# EAGLE design Sound_MP3-TF-16P (EAGLE 9.5.2)
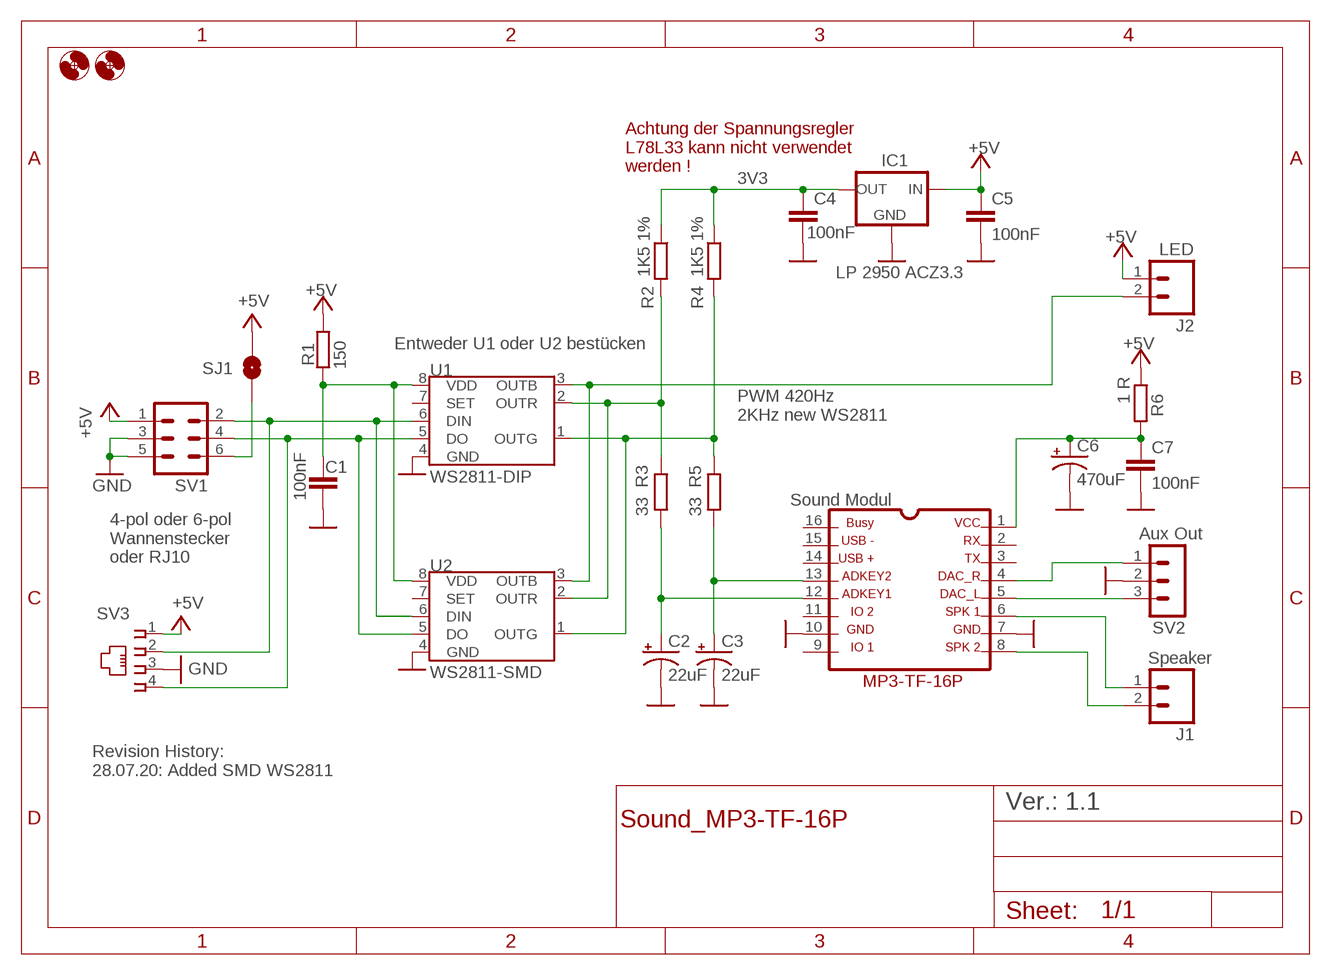
[diagram p0: schematic, sheet 1]

## Parts
C1  100nF  0.1UF-50V-20%(PTH)KIT-EZ  [CAP-PTH-SMALL-KIT]
C2  22uF  CAPACITORS_22UF  [CAPACITOR_CPOL-RADIAL-22UF]
C3  22uF  CAPACITORS_22UF  [CAPACITOR_CPOL-RADIAL-22UF]
C4  100nF  0.1UF-50V-20%(PTH)KIT-EZ  [CAP-PTH-SMALL-KIT]
C5  100nF  0.1UF-50V-20%(PTH)KIT-EZ  [CAP-PTH-SMALL-KIT]
C6  470uF  SPARKFUN-CAPACITORS_100UF-25V-20%(PTH)  [SPARKFUN-CAPACITORS_CPOL-RADIAL-100UF-25V]
C7  100nF  0.1UF-50V-20%(PTH)KIT-EZ  [CAP-PTH-SMALL-KIT]
H1  MOUNT-HOLE3.0  [3,0]
H3  MOUNT-HOLE3.0  [3,0]
IC1  LP 2950 ACZ3.3  78LXX  [78LXX]
J1  Speaker  M02PTH  [1X02]
J2  LED  M02PTH  [1X02]
MOD1  Sound Modul  MP3-TF-16P_MP3-TF-16P  [MP3-TF-16P_MP3-TF-16P]
R1  150  RCL_R-EU_0204/5  [RCL_0204/5]
R2  1K5 1%  RCL_R-EU_0204/5  [RCL_0204/5]
R3  33  RCL_R-EU_0204/5  [RCL_0204/5]
R4  1K5 1%  RCL_R-EU_0204/5  [RCL_0204/5]
R5  33  RCL_R-EU_0204/5  [RCL_0204/5]
R6  1 R  RCL_R-EU_0204/5  [RCL_0204/5]
SJ1  Pin6 = 5V  SOLDERJUMPERNO  [SJ_2S-NO]
SV1  ML6  [ML6]
SV2  Aux Out  MA03-1  [MA03-1]
SV3  RJ10RJ10_WO_OVERLAP  [RJ10_NO_OVERLAP_BORDER]
U1  WS2811-DIP  S3PO_MODUL_WS2811_SOUND_MP3-TF-16P_WS2811_AND_ATTINY_WS2811-ICTINY45-20-DIP  [S3PO_MODUL_WS2811_SOUND_MP3-TF-16P_WS2811_AND_ATTINY_WS2811_DIP08]
U2  WS2811-SMD  S3PO_MODUL_WS2811_SOUND_MP3-TF-16P_WS2811_AND_ATTINY_WS2811-ICTINY45-20-SMT  [S3PO_MODUL_WS2811_SOUND_MP3-TF-16P_WS2811_AND_ATTINY_WS2811_SO08-EIAJ]

## Nets
3V3: C4.1 IC1.OUT R2.1 R4.1
+5V: C5.1 IC1.IN J2.1 R1.2 R6.1 SJ1.1 SV1.1 SV3.1
+5V1: SJ1.2 SV1.6
G1: R4.2 R5.1 U1.1(OUTG) U2.1(OUTG)
GND: C1.2 C2.2(-) C3.2(-) C4.2 C5.2 C6.2(-) C7.2 IC1.GND MOD1.7 MOD1.10 SV1.3 SV1.5 SV2.2 SV3.3 U1.4(GND) U2.4(GND)
N$1: MOD1.5 SV2.3
N$2: MOD1.4 SV2.1
N$3: SV1.2 SV3.2 U1.6(DIN) U2.6(DIN)
N$4: SV1.4 SV3.4 U1.5(DO) U2.5(DO)
N$5: J1.1 MOD1.6
N$6: J1.2 MOD1.8
N$7: C2.1(+) MOD1.12 R3.2
N$8: C3.1(+) MOD1.13 R5.2
N$9: C6.1(+) C7.1 MOD1.1 R6.2
N$10: J2.2 U1.3(OUTB) U2.3(OUTB)
PWR1: C1.1 R1.1 U1.8(VDD) U2.8(VDD)
R1: R2.2 R3.1 U1.2(OUTR) U2.2(OUTR)
Unconnected: MOD1.2 MOD1.3 MOD1.9 MOD1.11 MOD1.14 MOD1.15 MOD1.16 U1.7(SET) U2.7(SET)

## Notes on the sheet
- Achtung der Spannungsregler
  L78L33 kann nicht verwendet
  werden !
- Entweder U1 oder U2 bestücken
- PWM 420Hz
  2KHz new WS2811
- 4-pol oder 6-pol 
  Wannenstecker
  oder RJ10
- Revision History:
  28.07.20: Added SMD WS2811
- Ver.: 1.1

## Library data of the parts
C1 C4 C5 C7 = SparkFun-Capacitors:0.1UF-50V-20%(PTH): CAP-08370; PROD_ID: CAP-08370
C2 C3 = Sound_MP3-TF-16P_WS2811_and_ATTiny:CAPACITORS_22UF: CAP-08439; PROD_ID: CAP-08439
C6 = Sound_MP3-TF-16P_and_WS2811:SPARKFUN-CAPACITORS_100UF-25V-20%(PTH): CAP-08439; PROD_ID: CAP-08439
H1 H3 = holes:MOUNT-HOLE: MOUNTING HOLE with drill center marker
IC1 = v-reg-3:78LXX: VOLTAGE REGULATOR
J1 J2 = SparkFun-Connectors:M02: Standard 2-pin 0.1" header. Use with - straight break away headers ( PRT-00116) - right angle break away headers (PRT-00553) - swiss pins (PRT-00743) - machine pins (PRT-00117) - female headers (PRT-00115) Molex polarized connector foot print use with: PRT-08233 with associated crimp pins and housings. 2.54_SCREWTERM for use with PRT-10571. 3.5mm Screw Terminal footprints for PRT-08084 5mm Screw Terminal footprints for use with PRT-08432
MOD1 = Sound_MP3-TF-16P_WS2811_and_ATTiny:MP3-TF-16P_MP3-TF-16P: MP3-TF-16P http://www.electronicoscaldas.com/datasheet/DFR0299-DFPlayer-Mini-Manual.pdf; OC_FARNELL: unknown; OC_NEWARK: unknown
R1-R6 = Sound_MP3-TF-16P_and_WS2811:RCL_R-EU_: RESISTOR, European symbol; SPICEPREFIX: R
SJ1 = SparkFun-Retired:SOLDERJUMPER: Solder Jumper Standard SMD solder jumper. Used to automate production. Two varients : Normally Open and Normally Closed are the same, but have different paste layers. NC will have a large amount of paste and should jumper during reflow.
SV1 = con-harting-ml:ML6: HARTING; OC_FARNELL: unknown; OC_NEWARK: unknown
SV2 = con-lstb:MA03-1: PIN HEADER
SV3 = RJ10:RJ10: RJ10 Connector "C:\Dat\Märklin\Schaltpläne\Allgemein\RJ10_Stecker_Layout.docx" https://de.aliexpress.com/item/100-pcs-lot-RJ11-Grau-4P4-Telefon-Buchse-4P4C-Telefon-Halter-RJ10-Telefon-Halter-PCB-Empf/32951511491.html?spm=a2g0x.search0604.3.106.53184c516NAPTE&transAbTest=ae803_4&ws_ab_test=searchweb0_0%2Csearchweb201602_3_10065_10068_10547_319_317_10548_10696_10084_453_10083_454_10618_10304_10307_10820_10821_537_10302_536_10902_10843_10059_10884_10887_321_322_10103%2Csearchweb201603_57%2CppcSwitch_0&algo_pvid=cf281ae9-d22a-4418-b1b2-d9dd3eca3a16&algo_expid=cf281ae9-d22a-4418-b1b2-d9dd3eca3a16-15
U1 = S3PO_Modul_WS2811:S3PO_MODUL_WS2811_SOUND_MP3-TF-16P_WS2811_AND_ATTINY_WS2811-IC: Die Pin Nummern für R und G sind getauscht damit sie gleich angesteuert werden wie die WS2812. Der Daten Strom der WS2811 ist RGB, Beim WS2812 ist es aber GRB.; PROD_ID: IC-09439; VALUE: TINY45-20-DIP
U2 = S3PO_Modul_WS2811:S3PO_MODUL_WS2811_SOUND_MP3-TF-16P_WS2811_AND_ATTINY_WS2811-IC: Die Pin Nummern für R und G sind getauscht damit sie gleich angesteuert werden wie die WS2812. Der Daten Strom der WS2811 ist RGB, Beim WS2812 ist es aber GRB.; PROD_ID: IC-08922; VALUE: Tiny45-20-SMT

## Board
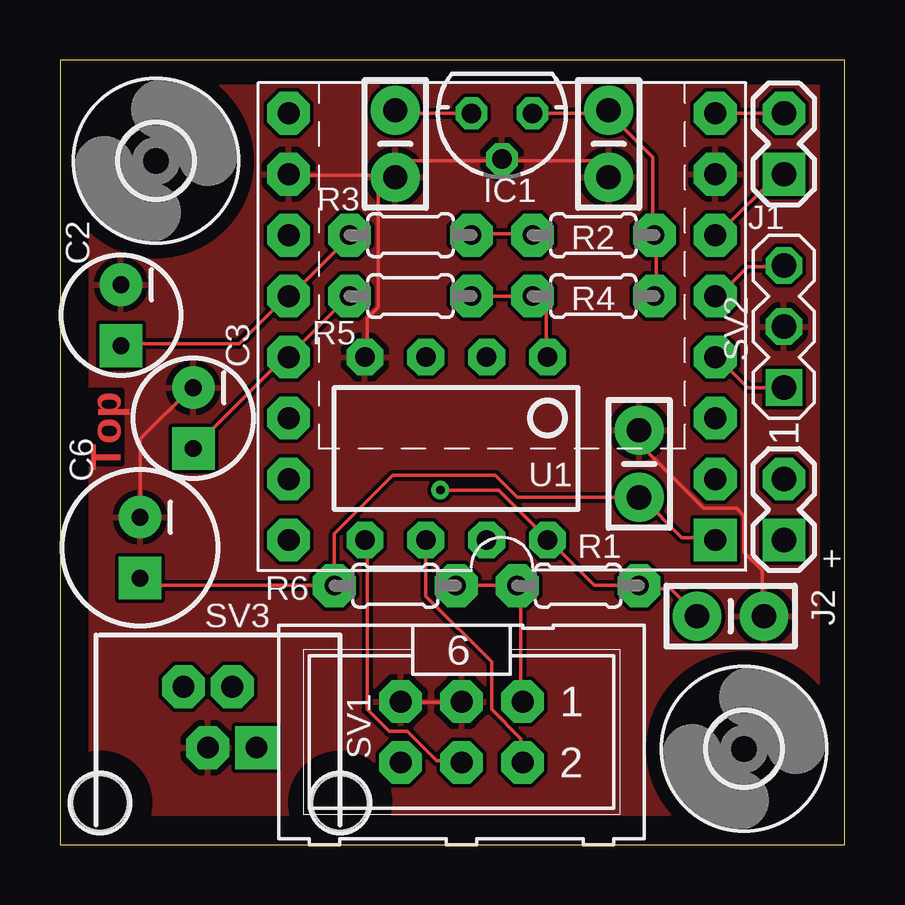
[diagram p1: board, top side]
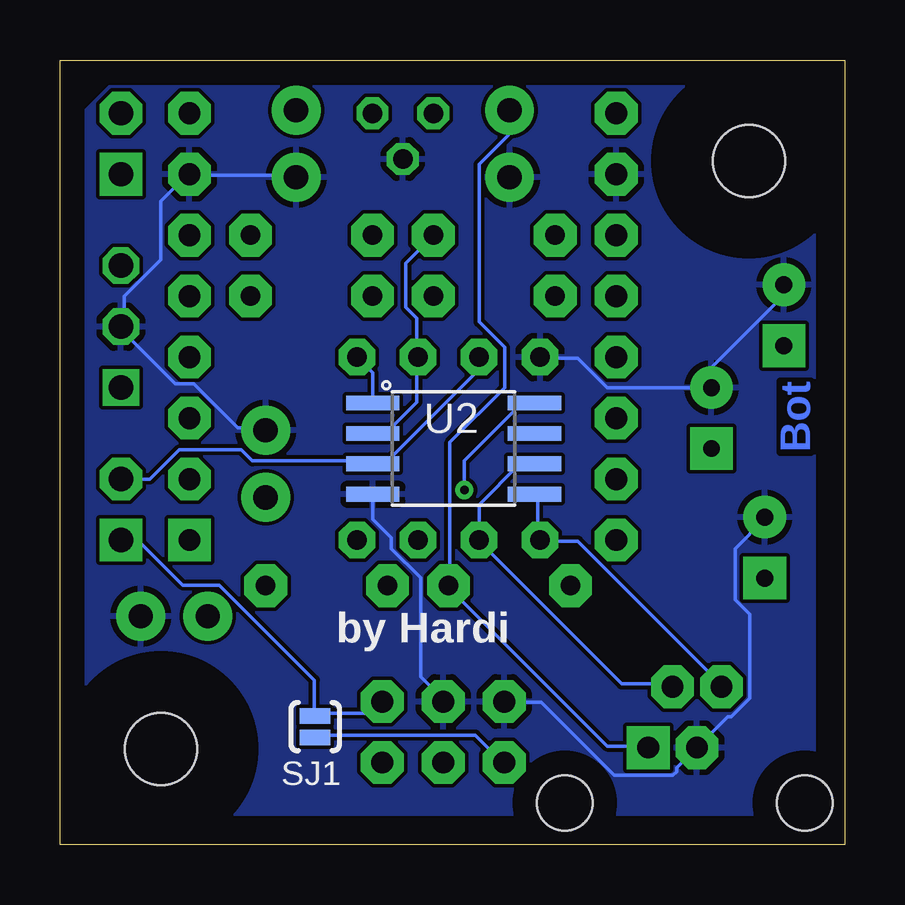
[diagram p2: board, bottom side, seen from below]

Size 32.7 x 32.7 mm. Coordinates in mm from the lower left corner, seen from the top.
Outline: 0,0 32.7,0 32.7,32.7 0,32.7 0,0
Copper layers (1*16): Top 0.035mm / dielectric 1.5mm / Bottom 0.035mm
Design rules "default": minimum track width 6mil, minimum drill 0.35mm, track to track 6mil, track to pad 6mil, pad to pad 6mil, via to via 6mil, smd to smd 6mil, copper to edge 40mil, drill to drill 6mil, minimum pad ring 10mil, minimum via ring 8mil, stop-mask expansion 4mil, vias tented up to drill 0mil, thermal gap 10mil

### Footprints (pad centres in the part's own frame; a part is rotated, then mirrored left to right if it is on the bottom)
CAP-PTH-SMALL-KIT = drill 1.016 pad 2.032: 1 -1.397,0; 2 1.397,0
CAPACITOR_CPOL-RADIAL-22UF = drill 0.7 pad 1.778 square: 1 1.27,0 | drill 0.7 pad 1.778: 2 -1.27,0
SPARKFUN-CAPACITORS_CPOL-RADIAL-100UF-25V = drill 0.7 pad 1.778 square: 1 1.27,0 | drill 0.7 pad 1.778: 2 -1.27,0
3,0 = hole 3: 0,0
78LXX = drill 0.813 octagon: GND 0,1.905; IN 1.27,0; OUT -1.27,0
1X02 = drill 1.016 pad 1.778 square: 1 0,0 | drill 1.016 pad 1.778 octagon: 2 2.54,0
MP3-TF-16P_MP3-TF-16P = drill 0.914 pad 1.778 square: 1 -8.89,16.51 | drill 0.914 pad 1.778 octagon: 2 -8.89,13.97; 3 -8.89,11.43; 4 -8.89,8.89; 5 -8.89,6.35; 6 -8.89,3.81; 7 -8.89,1.27; 8 -8.89,-1.27; 9 8.89,-1.27; 10 8.89,1.27; 11 8.89,3.81; 12 8.89,6.35; 13 8.89,8.89; 14 8.89,11.43; 15 8.89,13.97; 16 8.89,16.51
RCL_0204/5 = drill 0.813 pad 1.778 octagon: 1 -2.54,0; 2 2.54,0
SJ_2S-NO = smd 0.635 x 1.27: 1 -0.45,0; 2 0.45,0
ML6 = drill 0.914 pad 1.778 octagon: 1 -2.54,-1.27; 2 -2.54,1.27; 3 0,-1.27; 4 0,1.27; 5 2.54,-1.27; 6 2.54,1.27
MA03-1 = drill 1.016 pad 1.524 square: 1 -3.81,0 | drill 1.016 pad 1.524 octagon: 2 -1.27,0; 3 1.27,0
RJ10_NO_OVERLAP_BORDER = drill 0.9 pad 1.778 square: 1 -1.524,-2.3 | drill 0.9 pad 1.778 octagon: 2 -0.508,-4.84; 3 0.508,-2.3; 4 1.524,-4.84 | hole 2.3: 5,0; -5,0
S3PO_MODUL_WS2811_SOUND_MP3-TF-16P_WS2811_AND_ATTINY_WS2811_DIP08 = drill 0.813 pad 1.524 octagon: 1 -3.81,-3.81; 2 -1.27,-3.81; 3 1.27,-3.81; 4 3.81,-3.81; 5 3.81,3.81; 6 1.27,3.81; 7 -1.27,3.81; 8 -3.81,3.81
S3PO_MODUL_WS2811_SOUND_MP3-TF-16P_WS2811_AND_ATTINY_WS2811_SO08-EIAJ = smd 0.61 x 2.21: 1 -1.905,-3.378; 2 -0.635,-3.378; 3 0.635,-3.378; 4 1.905,-3.378; 5 1.905,3.353; 6 0.635,3.353; 7 -0.635,3.353; 8 -1.905,3.353

### Placement (x,y rotation side)
C1  27.94,9.53 0 top
C2  2.54,22.07 270 top
C3  5.56,17.78 270 top
C4  22.86,29.21 270 top
C5  13.97,29.21 270 top
C6  3.33,12.38 270 top
C7  24.13,15.88 90 top
H1  4,28.5 0 top
H3  28.5,4 0 top
IC1  18.41,30.48 180 top
J1  30.16,27.94 90 top
J2  30.16,12.7 90 top
MOD1  18.41,29.21 180 top
R1  21.59,10.79 180 top
R2  22.23,25.4 180 top
R3  14.61,25.4 180 top
R4  22.23,22.86 180 top
R5  14.61,22.86 180 top
R6  13.97,10.79 180 top
SJ1  22.07,4.92 270 bottom
SV1  16.73,4.7 180 top
SV2  30.16,22.86 90 top
SV3  6.67,1.75 180 top
U1  16.51,16.51 180 top
U2  16.28,16.51 270 bottom

### Tracks (layer width: path | path; a pad name or v marks a point on that pad's centre or on a via)
3V3
  Top 0.152: R4.1 24.84,22.86 24.84,25.3 R2.1 24.69,25.45 24.69,28.65 22.86,30.48 | 22.86,30.48 IC1.OUT | 22.86,30.48 C4.1
+5V
  Top 0.152: IC1.IN 14.02,30.48 C5.1 | R6.1 16.61,10.82 19.05,10.82 R1.2 19.05,10.67 19.2,10.52 19.2,6.1 SV1.1
  Bottom 0.152: SV1.1 19.36,5.94 19.81,5.49 21.95,5.49 SJ1.1 22.1,5.49 22.1,6.86 26.06,10.82 27.58,10.82 29.41,12.65 30.02,12.65 J2.1 | SV3.1 8.23,4.12 9.91,4.12 16.46,10.67 R6.1 16.46,10.82 16.46,16.76 14.17,19.05 14.17,20.73 15.24,21.79 15.24,28.35 14.02,29.57 14.02,30.48 C5.1
+5V1
  Bottom 0.152: SJ1.2 21.95,4.57 15.39,4.57 14.33,3.5 SV1.6
G1
  Top 0.152: U1.1 20.27,20.42 20.27,22.4 19.81,22.86 R4.2 R5.1
  Bottom 0.152: U2.1 19.66,19.66 U1.1
GND
  Top 0.152: SV1.3 16.61,5.94 14.33,5.94 SV1.5 | C6.2 3.35,13.72 3.35,16.92 5.49,19.05 C3.2 | C5.2 14.02,27.89 14.63,28.5 18.29,28.5 IC1.GND 18.44,28.5 22.25,28.5 22.86,27.89 C4.2 | 13.26,27.89 13.87,27.89 C5.2 | 13.26,27.89 9.6,27.89 MOD1.10 | C1.2 29.26,9.6 29.26,11.43 28.5,12.19 28.5,13.72 28.19,14.02 26.82,14.02 24.23,16.61 24.23,17.22 C7.2 | 13.26,27.89 13.26,22.4 12.8,21.95 12.8,20.42 U1.4 | 13.26,27.89 C5.2
  Bottom 0.152: U2.4 19.66,13.56 18.9,12.8 18.9,12.34 17.68,11.12 17.68,7.01 16.76,6.1 SV1.3 | SV1.5 14.17,5.94 12.65,5.94 9.6,2.9 7.16,2.9 7.01,3.05 7.01,3.2 6.25,3.96 SV3.3 6.1,4.12 4.88,5.33 4.72,5.33 3.96,6.1 3.96,9.6 4.57,10.21 4.57,12.34 3.35,13.56 C6.2 | U1.4 12.65,20.27 11.12,20.27 9.91,19.05 C3.2 5.49,19.05 5.49,19.96 2.59,22.86 2.59,23.32 C2.2 | C4.2 22.86,27.89 27.28,27.89 MOD1.7 27.43,27.89 28.5,26.82 28.5,24.38 30.02,22.86 30.02,21.64 SV2.2 30.18,21.49 27.89,19.2 27.13,19.2 25.3,17.37 24.23,17.37 C7.2
  pour Top: 1.27,31.75 31.75,31.75 31.75,1.27 1.27,1.27
  pour Bottom: 1.27,30.48 2.54,31.75 30.48,31.75 31.75,30.48 31.75,2.54 30.48,1.27 2.54,1.27 1.27,2.54
N$1
  Top 0.152: SV2.3 30.02,24.08 28.65,24.08 27.43,22.86 MOD1.5
N$2
  Top 0.152: SV2.1 28.65,19.05 27.43,20.27 MOD1.4
N$3
  Top 0.152: U1.6 15.24,10.36 17.98,7.62 17.98,5.64 19.2,4.42 19.2,3.5 SV1.2
  Bottom 0.152: U2.6 12.95,15.85 13.56,15.85 15.24,14.17 U1.6 15.24,12.65 9.3,6.71 7.32,6.71 SV3.2
N$4
  Top 0.152: SV1.4 16.61,3.5 15.7,3.5 14.48,4.72 13.72,4.72 12.8,5.64 12.8,12.65 U1.5
  Bottom 0.152: U2.5 12.8,14.48 12.8,12.8 U1.5 12.65,12.65 11.12,12.65 5.18,6.71 SV3.4
N$5
  Top 0.152: MOD1.6 27.43,25.45 30.02,28.04 J1.1
N$6
  Top 0.152: J1.2 MOD1.8
N$7
  Top 0.152: C2.1 2.59,20.88 7.47,20.88 9.45,22.86 MOD1.12 9.6,22.86 12.04,25.3 R3.2
N$8
  Top 0.152: C3.1 5.64,16.61 9.45,20.42 MOD1.13 9.6,20.42 12.04,22.86 R5.2
N$9
  Top 0.152: MOD1.1 27.28,12.8 25.91,12.8 24.23,14.48 C7.1 19.05,14.48 18.14,15.39 13.87,15.39 11.43,12.95 11.43,10.82 | 11.43,10.82 3.5,10.82 3.35,10.97 C6.1 | 11.43,10.82 R6.2
N$10
  Bottom 0.152: 19.66,16 19.05,16 15.24,19.81 U1.3 | J2.2 28.96,15.24 27.74,16.46 25.15,16.46 24.69,16 19.66,16 | 19.66,16 U2.3
PWR1  (via drill 0.35)
  Top 0.152: C1.1 26.52,9.6 25.45,10.67 24.23,10.67 R1.1 24.08,10.82 22.25,10.82 20.42,12.65 U1.8 20.27,12.8 18.29,14.78 v15.85,14.78
  Bottom 0.152: v15.85,14.78 15.85,16 13.56,18.29 12.95,18.29 U2.8
R1
  Top 0.152: R3.1 17.22,25.45 19.66,25.45 R2.2
  Bottom 0.152: U2.2 19.66,17.22 19.05,17.22 17.83,18.44 17.83,20.27 U1.2 17.83,20.42 17.83,21.95 18.29,22.4 18.29,24.23 17.22,25.3 R3.1

### Text on the board
Top: Top
Bottom: Bot
tNames: +
bNames: by Hardi
tDocu: 28.07.20 | MP3-TF-16P | Sound Modul | V 1.0 | by Hardi
bDocu: MP3-TF-16P / Sound Modul | V 1.1 | by Hardi